# Altium schematic sheet Sheet1.SchDoc
size A4
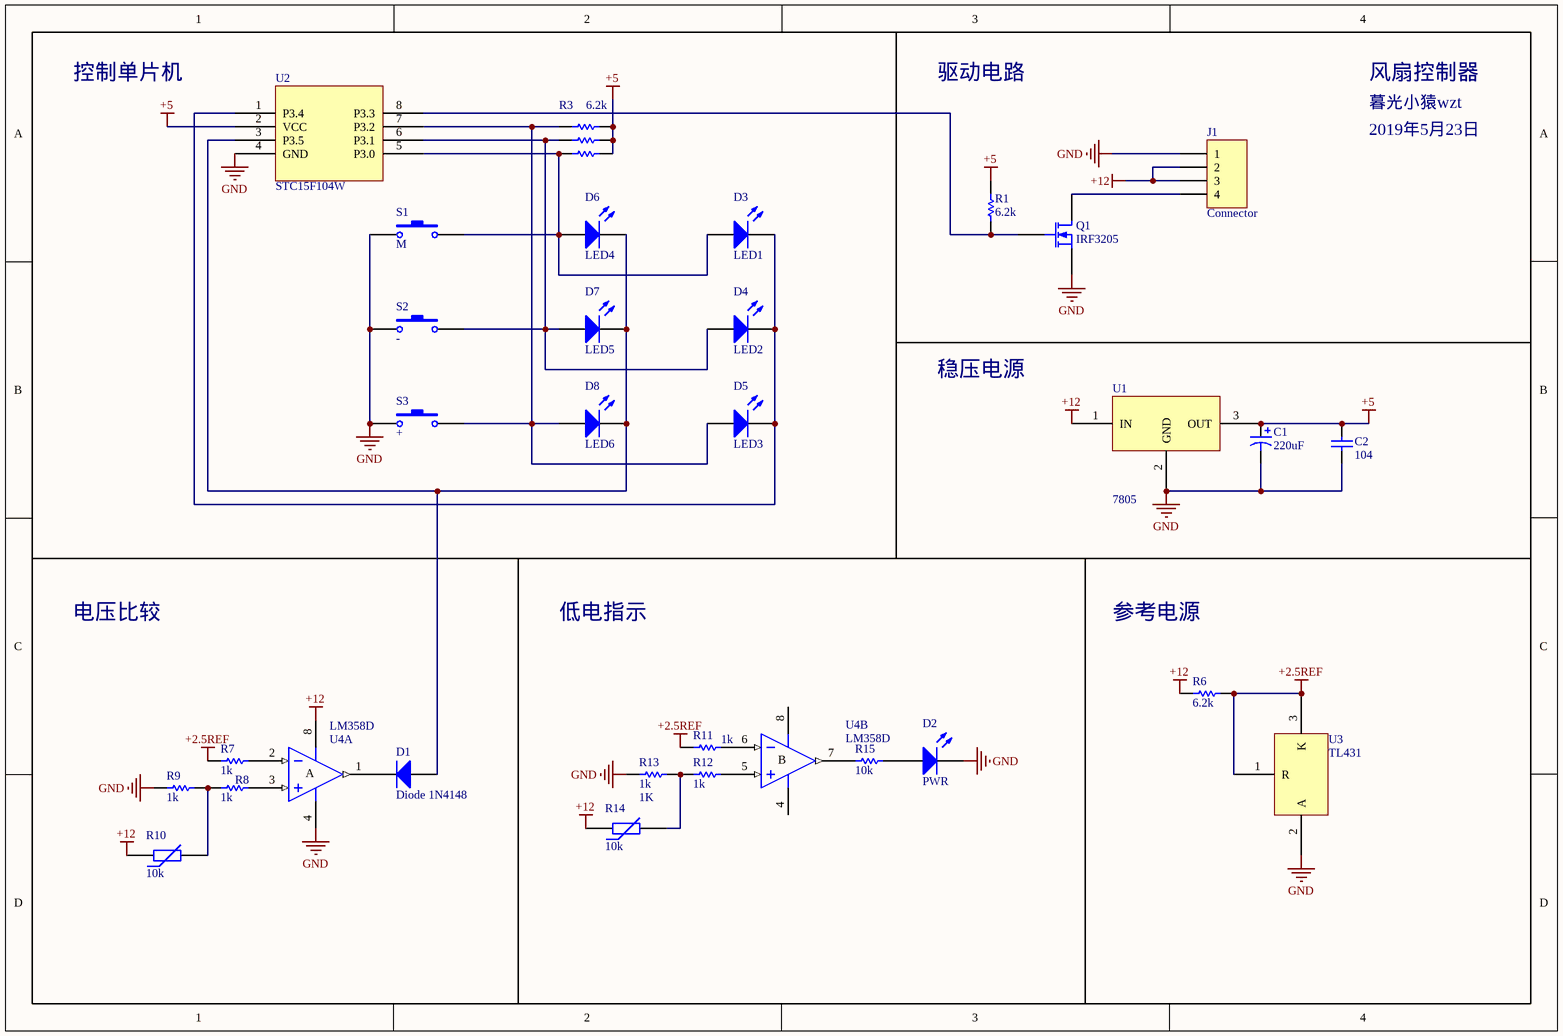
[diagram p0: Sheet1.SchDoc]

## Parts
C1  220uF  [RB7.6-15]
C2  104  [RAD-0.3]
D1  Diode 1N4148  [DO-35]
D2  PWR  [LED-0]
D3  LED1  [LED-0]
D4  LED2  [LED-0]
D5  LED3  [LED-0]
D6  LED4  [LED-0]
D7  LED5  [LED-0]
D8  LED6  [LED-0]
J1  Connector  [HDR1X4]
Q1  IRF3205  [E3]
R1  6.2k  [AXIAL-0.3]
R3  6.2k  [AXIAL-0.3]
R4  6.2k  [AXIAL-0.3]  (value not drawn)
R5  6.2k  [AXIAL-0.3]  (value not drawn)
R6  6.2k  [AXIAL-0.3]
R7  1k  [AXIAL-0.3]
R8  1k  [AXIAL-0.3]
R9  1k  [AXIAL-0.3]
R10  10k  [6-0805_N]
R11  1k  [AXIAL-0.3]
R12  1k  [AXIAL-0.3]
R13  1k  [AXIAL-0.3]
R14  10k  [6-0805_N]
R15  10k  [AXIAL-0.3]
S1  M  [SPST-2]
S2  -  [SPST-2]
S3  +  [SPST-2]
U1  7805
U2  STC15F104W
U3  TL431
U4  LM358D  [D008_L]  (parts A,B of 2)

## Nets
+2.5REF: R6.2 R7.1 R11.1 U3.1(R) U3.3(K)
+5: C1.1 C2.2 R1.2 R3.2 R4.2 R5.2 U1.3(OUT) U2.2(VCC)
+12: J1.2 J1.3 R6.1 R10.1 R14.1 U1.1(IN) U4.8(V+)
GND: C1.2 C2.1 D2.2(K) J1.1 Q1.3(S) R9.1 R13.1 S1.1 S2.1 S3.1 U1.2(GND) U2.4(GND) U3.2(A) U4.4(V-)
NetD1_1: D1.1(A) D6.2(K) D7.2(K) D8.2(K) U2.3(P3.5)
NetD1_2: D1.2(K) U4.1(OUT)
NetD2_1: D2.1(A) R15.2
NetD3_1: D3.1(A) D6.1(A) R5.1 S1.2 U2.5(P3.0)
NetD3_2: D3.2(K) D4.2(K) D5.2(K) U2.1(P3.4)
NetD4_1: D4.1(A) D7.1(A) R4.1 S2.2 U2.6(P3.1)
NetD5_1: D5.1(A) D8.1(A) R3.1 S3.2 U2.7(P3.2)
NetJ1_4: J1.4 Q1.1(D)
NetQ1_2: Q1.2(G) R1.1 U2.8(P3.3)
NetR7_2: R7.2 U4.2(IN-)
NetR8_1: R8.1 R9.2 R10.2
NetR8_2: R8.2 U4.3(IN+)
NetR11_2: R11.2 U4.6(IN-)
NetR12_1: R12.1 R13.2 R14.2
NetR12_2: R12.2 U4.5(IN+)
NetR15_1: R15.1 U4.7(OUT)

## Notes on the sheet
- 控制单片机
- 驱动电路
- 风扇控制器
- 暮光小猿wzt
- 2019年5月23日
- 稳压电源
- 电压比较
- 低电指示
- 参考电源
- (in symbol LM358D, part A) A
- (in symbol LM358D, part B) B

## Library data of the parts
C1 = Cap Pol1: Polarized Capacitor (Radial); Value: 100pF; Published: 8-Jun-2000; LatestRevisionDate: 17-Jul-2002; LatestRevisionNote: Re-released for DXP Platform.; PackageReference: RB7.6-15; Publisher: Altium Limited; PackageDescription: Polarized Capacitor (Radial); 2 Leads
C2 = Cap: Capacitor; Value: 100pF; Published: 8-Jun-2000; LatestRevisionDate: 17-Jul-2002; LatestRevisionNote: Re-released for DXP Platform.; PackageReference: RAD-0.3; Publisher: Altium Limited; PackageDescription: Radial Cap, Thru-Hole; 2 Leads; 0.3 in Pin Spacing
D1 = Diode 1N4148: High Conductance Fast Diode; Published: 8-Jun-2000; LatestRevisionDate: 17-Jul-2002; LatestRevisionNote: Re-released for DXP Platform.; DatasheetVersion: 1997; PackageReference: DO-35; Publisher: Altium Limited; PackageDescription: Diode, Axial; Body 3.8 x 1.9 mm (LxDia. max), Lead Dia. 0.53 mm (max); Code_JEDEC: DO-204-AH; ComponentLink1Description: Manufacturer Link; ComponentLink1URL: http://www.fairchildsemi.com/; ComponentLink2Description: Datasheet; ComponentLink2URL: http://www.fairchildsemi.com/ds/1N%2F1N4148.pdf
D2-D8 = LED0: Typical INFRARED GaAs LED; Published: 8-Jun-2000; LatestRevisionDate: 08-Jul-2005; LatestRevisionNote: Mech Layer 1 removed.; PackageReference: LED-0; Publisher: Altium Limited; PackageDescription: LED; 2 Leads
J1 = Header 4: Header, 4-Pin; LatestRevisionDate: 17-Jul-2002; LatestRevisionNote: Re-released for DXP Platform.; Publisher: Altium Limited
Q1 = MOSFET-N: N-Channel MOSFET; Published: 8-Jun-2000; LatestRevisionDate: 17-Jul-2002; LatestRevisionNote: Re-released for DXP Platform.; PackageVersion: 1995/1996; PackageReference: E3; Publisher: Altium Limited; PackageDescription: TO, Flat Index; 3 In-Line, Axial Leads; Body Dia. 4.6mm; Lead Dia. 0.5 mm (max)
R1 R3-R6 R15 = Res1: Resistor; Value: 1K; Published: 8-Jun-2000; LatestRevisionDate: 17-Jul-2002; LatestRevisionNote: Re-released for DXP Platform.; PackageReference: AXIAL-0.3; Publisher: Altium Limited; PackageDescription: Axial Device, Thru-Hole; 2 Leads; 0.3 in Pin Spacing
R7-R9 R11-R13 = Res1: Resistor; Published: 8-Jun-2000; LatestRevisionDate: 17-Jul-2002; LatestRevisionNote: Re-released for DXP Platform.; PackageReference: AXIAL-0.3; Publisher: Altium Limited; PackageDescription: Axial Device, Thru-Hole; 2 Leads; 0.3 in Pin Spacing; Value: 1K
R10 R14 = Res Varistor: Varistor (Voltage-Sensitive Resistor); Published: 24-Mar-1999; LatestRevisionDate: 29-May-2009; LatestRevisionNote: IPC-7351 Footprint Added.; PackageVersion: Mar-2003; PackageReference: 6-0805; Publisher: Altium Limited; PackageDescription: Chip Resistor 0805 Case Size; Code_IPC: RESC2012
S1-S3 = SW-PB: Switch; Published: 24-Mar-1999; LatestRevisionDate: 17-Jul-2002; LatestRevisionNote: Re-released for DXP Platform.; PackageReference: SPST-2; Publisher: Altium Limited; PackageDescription: Switch; 2 Leads
U4 = LM358D: Dual Operational Amplifier; Published: 16-Jan-2001; LatestRevisionDate: 13-Apr-2006; LatestRevisionNote: IPC-7351 Footprint Added.; DatasheetVersion: Jul-1998; PackageVersion: Jan-1998; PackageReference: D008; Publisher: Altium Limited; PackageDescription: 8-Pin Small Outline Integrated Circuit 1.27 mm Pitch; Code_IPC: SOIC127P600-8; ComponentLink1Description: Manufacturer Link; ComponentLink1URL: http://www.ti.com/; ComponentLink2Description: Datasheet; ComponentLink2URL: http://www-s.ti.com/sc/ds/lm358.pdf